# EAGLE schematic Lora Rain gauge (EAGLE 9.6.2)
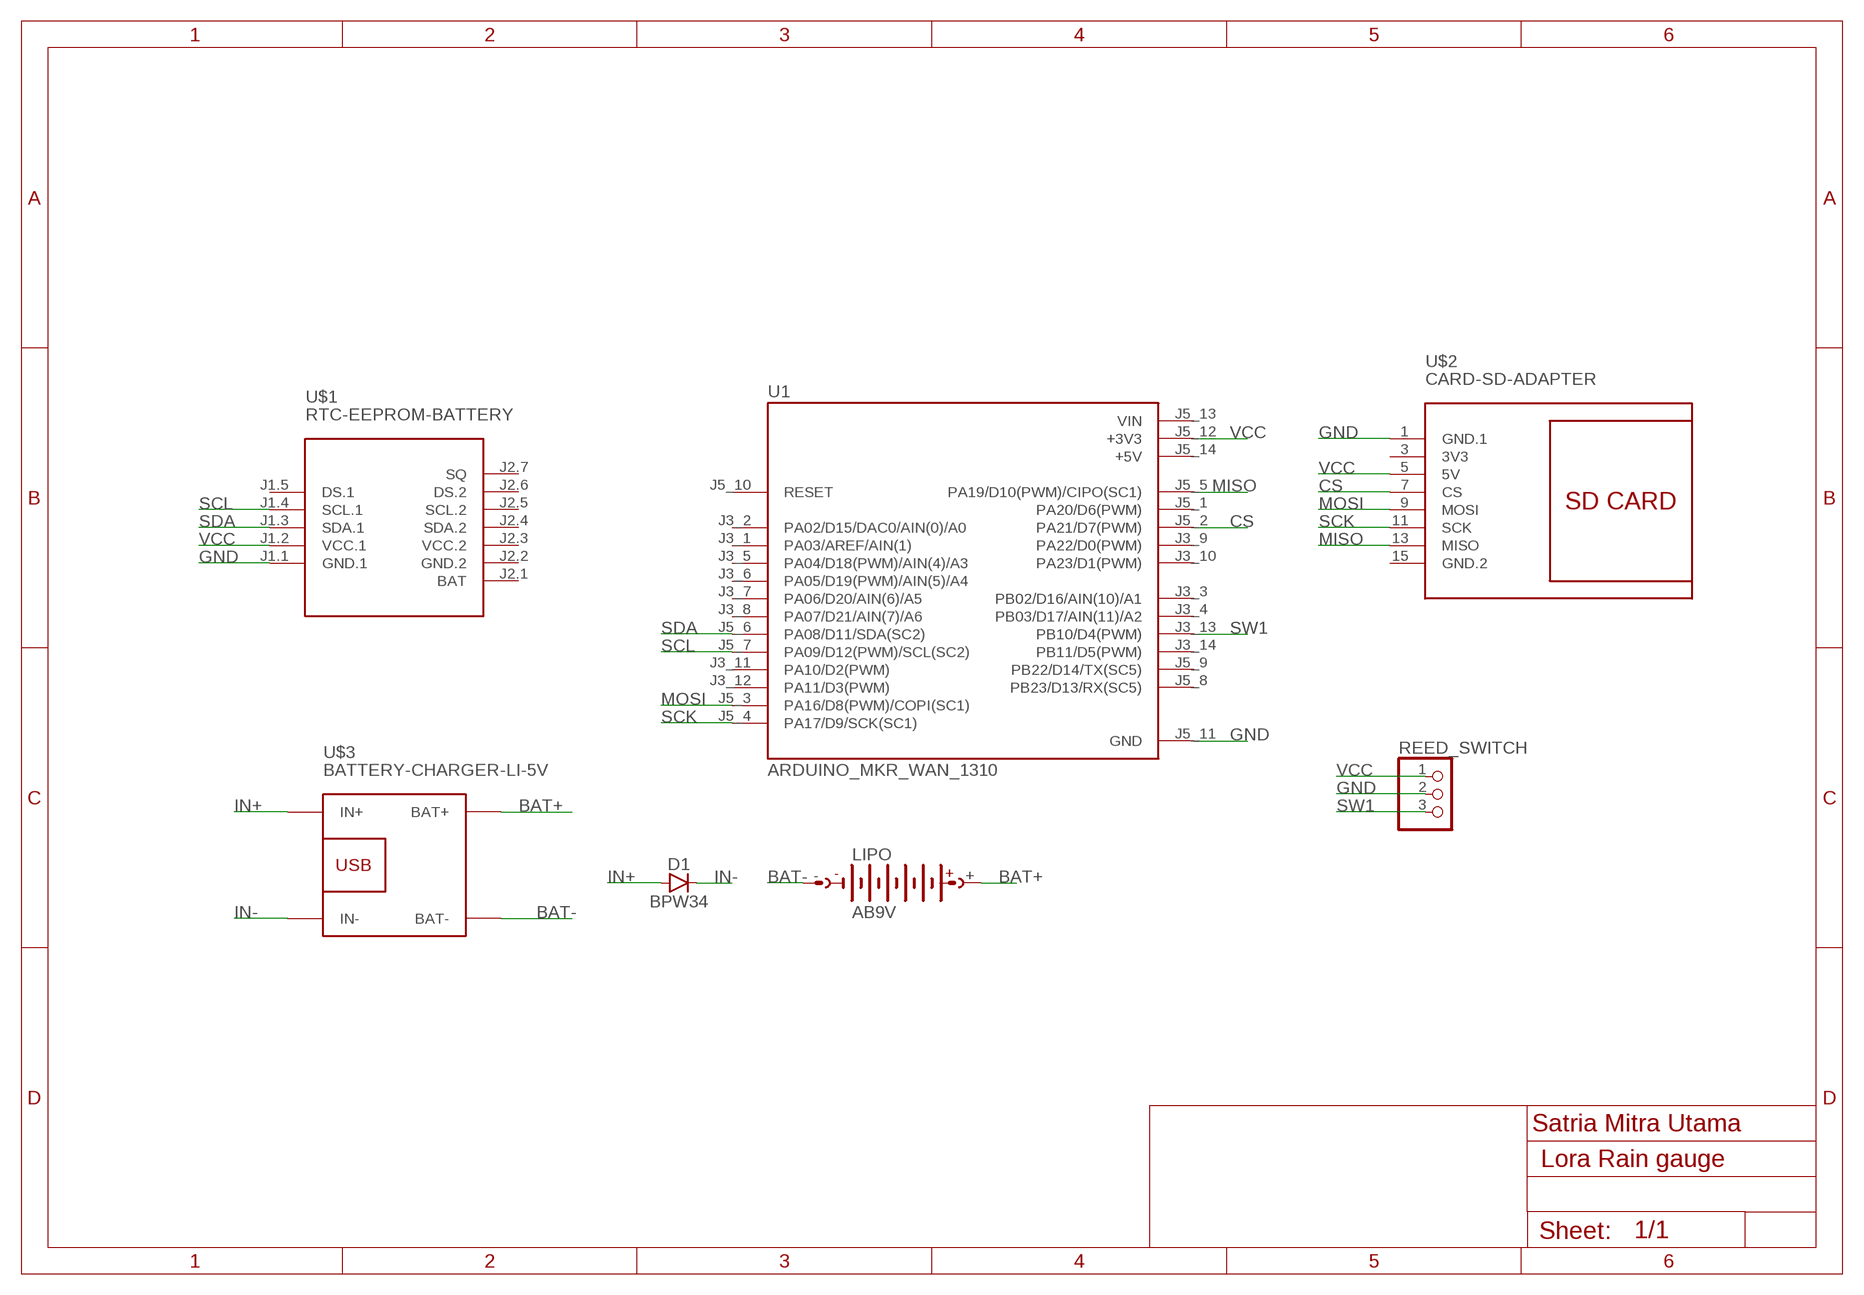
[diagram p0: schematic, sheet 1]

## Parts
D1  BPW34  [BPW34]
LIPO  AB9V  [AB9V]
REED_SWITCH  PINHD-1X3CB  [1X03-CLEANBIG]
U1  ARDUINO_MKR_WAN_1310  [BOARD_ARDUINO_MKR_WAN_1310]
U$1  RTC-EEPROM-BATTERY  [RTC_EEPROM_BATTERY]
U$2  CARD-SD-ADAPTER  [CARD-SD-ADAPTER]
U$3  BATTERY-CHARGER-LI-5V  [BATTERY-CHARGER-LI-5V]

## Nets
BAT+: LIPO.+ U$3.BAT+
BAT-: LIPO.- U$3.BAT-
CS: U1.J5_2(PA21/D7(PWM)) U$2.7(CS)
GND: REED_SWITCH.2 U1.J5_11(GND) U$1.J1.1(GND.1) U$2.1(GND.1)
IN+: D1.P$1(A) U$3.IN+
IN-: D1.P$2(C) U$3.IN-
MISO: U1.J5_5(PA19/D10(PWM)/CIPO(SC1)) U$2.13(MISO)
MOSI: U1.J5_3(PA16/D8(PWM)/COPI(SC1)) U$2.9(MOSI)
SCK: U1.J5_4(PA17/D9/SCK(SC1)) U$2.11(SCK)
SCL: U1.J5_7(PA09/D12(PWM)/SCL(SC2)) U$1.J1.4(SCL.1)
SDA: U1.J5_6(PA08/D11/SDA(SC2)) U$1.J1.3(SDA.1)
SW1: REED_SWITCH.3 U1.J3_13(PB10/D4(PWM))
VCC: REED_SWITCH.1 U1.J5_12(+3V3) U$1.J1.2(VCC.1) U$2.5(5V)
Unconnected: U1.J3_1(PA03/AREF/AIN(1)) U1.J3_2(PA02/D15/DAC0/AIN(0)/A0) U1.J3_3(PB02/D16/AIN(10)/A1) U1.J3_4(PB03/D17/AIN(11)/A2) U1.J3_5(PA04/D18(PWM)/AIN(4)/A3) U1.J3_6(PA05/D19(PWM)/AIN(5)/A4) U1.J3_7(PA06/D20/AIN(6)/A5) U1.J3_8(PA07/D21/AIN(7)/A6) U1.J3_9(PA22/D0(PWM)) U1.J3_10(PA23/D1(PWM)) U1.J3_11(PA10/D2(PWM)) U1.J3_12(PA11/D3(PWM)) U1.J3_14(PB11/D5(PWM)) U1.J5_1(PA20/D6(PWM)) U1.J5_8(PB23/D13/RX(SC5)) U1.J5_9(PB22/D14/TX(SC5)) U1.J5_10(RESET) U$1.J1.5(DS.1) U$1.J2.1(BAT) U$1.J2.4(SDA.2) U$1.J2.5(SCL.2) U$1.J2.6(DS.2) U$1.J2.7(SQ)

## Notes on the sheet
- Satria Mitra Utama

## Power pins joined to a net without a drawn wire
3V3: U$2.3(3V3)
+5V: U1.J5_14(+5V)
GND.2: U$1.J2.2(GND.2) U$2.15(GND.2)
VCC.2: U$1.J2.3(VCC.2)
VIN: U1.J5_13(VIN)

## Library data of the parts
D1 = SparkFun-Sensors:BPW34: Vishay BPW34 Silicon PIN Photodiode (Miniature Solar Cell) BPW34 is a PIN photodiode with high speed and high radiant sensitivity in miniature, flat, top view, clear plastic package. It is sensitive to visible and near infrared radiation. BPW34S is packed in tubes, specifications like BPW34. Datasheet: https://www.sparkfun.com/datasheets/Prototyping/Solar/bpw34.pdf SparkFun Products Miniature Solar Cell - BPW34 <https://www.sparkfun.com/products/9541> (PRT-09541); SF_ID: PRT-09541
LIPO = battery:AB9V: 9-V BATTERY CLIP
REED_SWITCH = adafruit:PINHD-1X3: PIN HEADER
U1 = ARDUINO_MKR_WAN_1310:ARDUINO_MKR_WAN_1310: Check availability <https://pricing.snapeda.com/parts/ARDUINO%20MKR%20WAN%201310/Arduino/view-part?ref=eda>; AVAILABILITY: Not in stock; CHECK_PRICES: https://www.snapeda.com/parts/ARDUINO%20MKR%20WAN%201310/Arduino/view-part/?ref=eda; DESCRIPTION: Arduino Pro; LoRa; SAM D21; 5VDC; Flash: 256kB; SRAM: 32kB; MF: Arduino; MP: ARDUINO MKR WAN 1310; PACKAGE: None; PRICE: None; SNAPEDA_LINK: https://www.snapeda.com/parts/ARDUINO%20MKR%20WAN%201310/Arduino/view-part/?ref=snap
U$1 = diy-modules:RTC-EEPROM-BATTERY: RTC Module with Battery and EEPROM based on DS1307 and AT24C32 chips
U$2 = diy-modules:CARD-SD-ADAPTER: Full Size SD Card Adapter Module with onboard 3.3V regulator
U$3 = diy-modules:BATTERY-CHARGER-LI-5V: Lithium Battery 5V Charger